# Altium schematic sheet tcrt_0.SchDoc
size A4
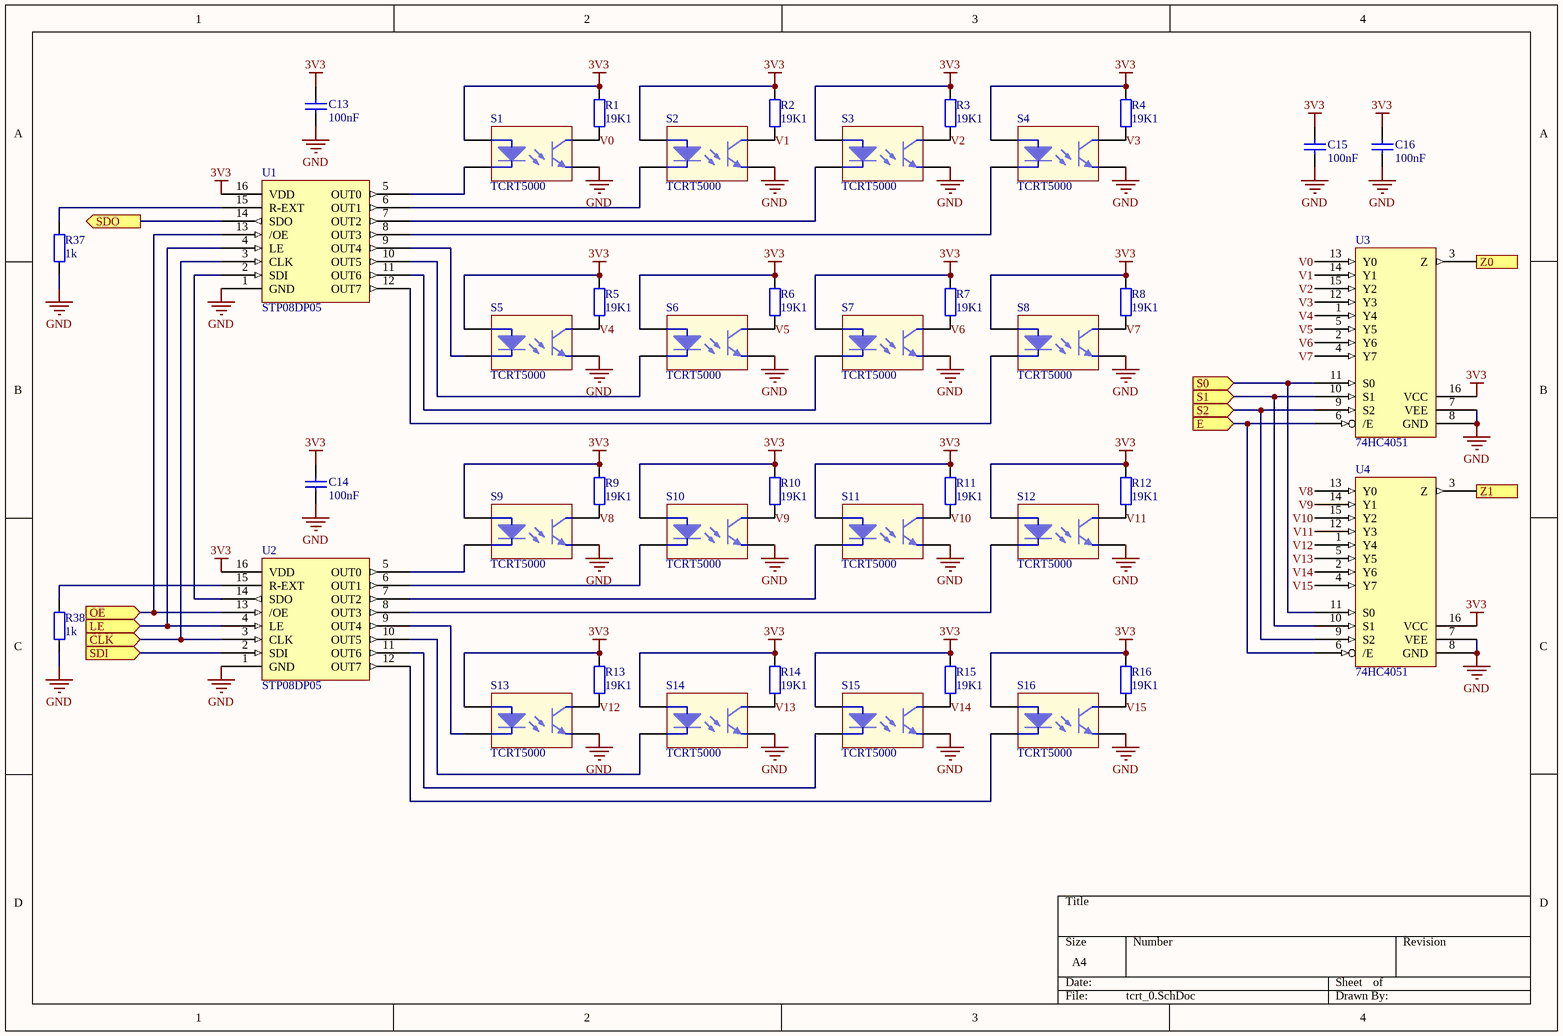
[diagram p0: tcrt_0.SchDoc]

## Parts
C13  100nF  [FP_0805_CAP_085]
C14  100nF  [FP_0805_CAP_085]
C15  100nF  [FP_0805_CAP_085]
C16  100nF  [FP_0805_CAP_085]
R1  19K1  [FP_0805_RES]
R2  19K1  [FP_0805_RES]
R3  19K1  [FP_0805_RES]
R4  19K1  [FP_0805_RES]
R5  19K1  [FP_0805_RES]
R6  19K1  [FP_0805_RES]
R7  19K1  [FP_0805_RES]
R8  19K1  [FP_0805_RES]
R9  19K1  [FP_0805_RES]
R10  19K1  [FP_0805_RES]
R11  19K1  [FP_0805_RES]
R12  19K1  [FP_0805_RES]
R13  19K1  [FP_0805_RES]
R14  19K1  [FP_0805_RES]
R15  19K1  [FP_0805_RES]
R16  19K1  [FP_0805_RES]
R37  1k  [FP_0805_RES]
R38  1k  [FP_0805_RES]
S1  TCRT5000  [TCRT5000_nohole]
S2  TCRT5000  [TCRT5000_nohole]
S3  TCRT5000  [TCRT5000_nohole]
S4  TCRT5000  [TCRT5000_nohole]
S5  TCRT5000  [TCRT5000_nohole]
S6  TCRT5000  [TCRT5000_nohole]
S7  TCRT5000  [TCRT5000_nohole]
S8  TCRT5000  [TCRT5000_nohole]
S9  TCRT5000  [TCRT5000_nohole]
S10  TCRT5000  [TCRT5000_nohole]
S11  TCRT5000  [TCRT5000_nohole]
S12  TCRT5000  [TCRT5000_nohole]
S13  TCRT5000  [TCRT5000_nohole]
S14  TCRT5000  [TCRT5000_nohole]
S15  TCRT5000  [TCRT5000_nohole]
S16  TCRT5000  [TCRT5000_nohole]
U1  STP08DP05  [TSSOP16_2]
U2  STP08DP05  [TSSOP16_2]
U3  74HC4051  [TSSOP16_2]
U4  74HC4051  [TSSOP16_2]

## Ports
CLK (in), E (in), LE (in), OE (in), S0 (in), S1 (in), S2 (in), SDI (in), SDO (out), Z0 (out), Z1 (out)

## Nets
3V3: C13.2 C14.2 C15.2 C16.2 R1.2 R2.2 R3.2 R4.2 R5.2 R6.2 R7.2 R8.2 R9.2 R10.2 R11.2 R12.2 R13.2 R14.2 R15.2 R16.2 S1.A S2.A S3.A S4.A S5.A S6.A S7.A S8.A S9.A S10.A S11.A S12.A S13.A S14.A S15.A S16.A U1.16(VDD) U2.16(VDD) U3.16(VCC) U4.16(VCC)
GND: C13.1 C14.1 C15.1 C16.1 R37.2 R38.2 S1.E S2.E S3.E S4.E S5.E S6.E S7.E S8.E S9.E S10.E S11.E S12.E S13.E S14.E S15.E S16.E U1.1(GND) U2.1(GND) U3.7(VEE) U3.8(GND) U4.7(VEE) U4.8(GND)
CLK: U1.3(CLK) U2.3(CLK) ; port CLK
E: U3.6(/E) U4.6(/E) ; port E
LE: U1.4(LE) U2.4(LE) ; port LE
OE: U1.13(/OE) U2.13(/OE) ; port OE
S0: U3.11(S0) U4.11(S0) ; port S0
S1: U3.10(S1) U4.10(S1) ; port S1
S2: U3.9(S2) U4.9(S2) ; port S2
SDI: U2.2(SDI) ; port SDI
SDO: U1.14(SDO) ; port SDO
V0: R1.1 S1.Coll(C) U3.13(Y0)
V1: R2.1 S2.Coll(C) U3.14(Y1)
V2: R3.1 S3.Coll(C) U3.15(Y2)
V3: R4.1 S4.Coll(C) U3.12(Y3)
V4: R5.1 S5.Coll(C) U3.1(Y4)
V5: R6.1 S6.Coll(C) U3.5(Y5)
V6: R7.1 S7.Coll(C) U3.2(Y6)
V7: R8.1 S8.Coll(C) U3.4(Y7)
V8: R9.1 S9.Coll(C) U4.13(Y0)
V9: R10.1 S10.Coll(C) U4.14(Y1)
V10: R11.1 S11.Coll(C) U4.15(Y2)
V11: R12.1 S12.Coll(C) U4.12(Y3)
V12: R13.1 S13.Coll(C) U4.1(Y4)
V13: R14.1 S14.Coll(C) U4.5(Y5)
V14: R15.1 S15.Coll(C) U4.2(Y6)
V15: R16.1 S16.Coll(C) U4.4(Y7)
Z0: U3.3(Z) ; port Z0
Z1: U4.3(Z) ; port Z1
NetR37_1: R37.1 U1.15(R-EXT)
NetR38_1: R38.1 U2.15(R-EXT)
NetS1_Cath: S1.Cath(K) U1.5(OUT0)
NetS2_Cath: S2.Cath(K) U1.6(OUT1)
NetS3_Cath: S3.Cath(K) U1.7(OUT2)
NetS4_Cath: S4.Cath(K) U1.8(OUT3)
NetS5_Cath: S5.Cath(K) U1.9(OUT4)
NetS6_Cath: S6.Cath(K) U1.10(OUT5)
NetS7_Cath: S7.Cath(K) U1.11(OUT6)
NetS8_Cath: S8.Cath(K) U1.12(OUT7)
NetS9_Cath: S9.Cath(K) U2.5(OUT0)
NetS10_Cath: S10.Cath(K) U2.6(OUT1)
NetS11_Cath: S11.Cath(K) U2.7(OUT2)
NetS12_Cath: S12.Cath(K) U2.8(OUT3)
NetS13_Cath: S13.Cath(K) U2.9(OUT4)
NetS14_Cath: S14.Cath(K) U2.10(OUT5)
NetS15_Cath: S15.Cath(K) U2.11(OUT6)
NetS16_Cath: S16.Cath(K) U2.12(OUT7)
NetU1_2: U1.2(SDI) U2.14(SDO)

## Library data of the parts
C13-C16 = CAP: Capacitor; Name: 100nF 0805 10% 50V X7R 0805B104K500CT (WAL); Supplier: Lomex; Reference: 82-10-76; Value: 100nF
R1-R16 = RES: Resistor; Name: 19K1 0805 1% RC0805FR-0719K1L 0.125W (YAG); Supplier: Lomex; Reference: 80-19-57; Value: 19K1
R37 R38 = RES: Resistor; Name: 1K00 0805 5% RC0805JR-101KL 0.125W (YAG); Supplier: Lomex; Reference: 81-34-72; Value: 1k
S1-S16 = TCRT5000: Reflective Optical Sensor; Reference: 1003.5545; Name: IR érzékelő; Supplier: Hestore
U1 U2 = STP08DP05: LED driver [8]; Reference: 2460707; Name: Led Driver, 8 Outputs, Constant Current, 3V-5.5V in; Supplier: Farnell
U3 U4 = 74HC4051: Analog multiplexer; Reference: 2445304; Name: Analog Multiplexer / Demultiplexer, 8:1, 1 Circuit, 180 ohm, 2V to 10V; Supplier: Farnell